# Altium schematic sheet 24.063.SchDoc
size A4
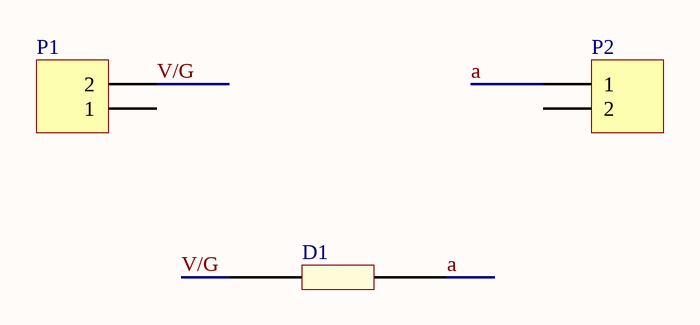
[diagram p0: 24.063.SchDoc]

## Parts
D1  resistor  [RES 1608?]  (value not drawn)
P1  Header 2  [HDR1X2]  (value not drawn)
P2  Header 2  [HDR1X2]  (value not drawn)

## Nets
a: D1.2 P2.1
V/G: D1.1 P1.2

Not connected (* = marked no-connect by the designer): P1 1; P2 2

## Library data of the parts
D1 = RES
P1 P2 = Header 2: Header, 2-Pin; LatestRevisionDate: 17-Jul-2002; LatestRevisionNote: Re-released for DXP Platform.; Publisher: Altium Limited